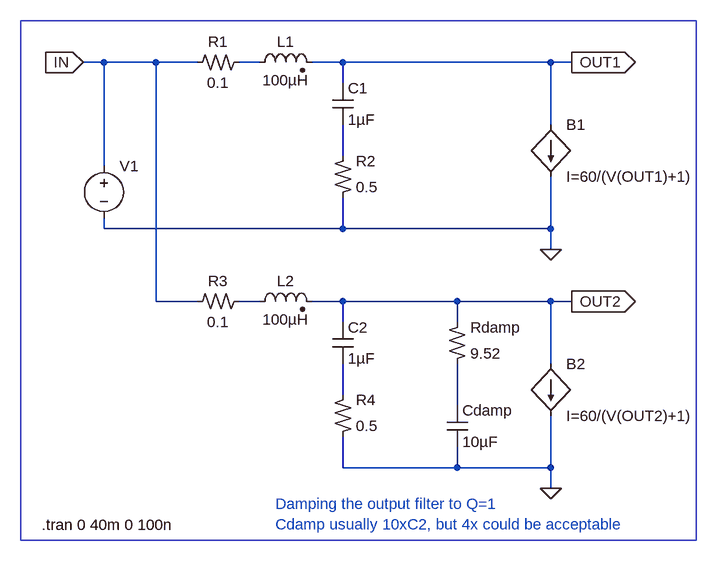
[diagram p0: schematic Switch-Mode Power Supplies - Basso- Figure 1-60.asc]
Switch-Mode Power Supplies - Basso- Figure 1-60.asc, the LTspice schematic file:
Version 4
SHEET 1 880 1052
WIRE -1888 -832 -1920 -832
WIRE -1808 -832 -1888 -832
WIRE -1744 -832 -1808 -832
WIRE -1648 -832 -1680 -832
WIRE -1520 -832 -1568 -832
WIRE -1200 -832 -1520 -832
WIRE -1168 -832 -1200 -832
WIRE -1520 -800 -1520 -832
WIRE -1200 -736 -1200 -832
WIRE -1520 -688 -1520 -736
WIRE -1888 -672 -1888 -832
WIRE -1888 -576 -1888 -592
WIRE -1520 -576 -1520 -624
WIRE -1520 -576 -1888 -576
WIRE -1200 -576 -1200 -656
WIRE -1200 -576 -1520 -576
WIRE -1200 -544 -1200 -576
WIRE -1808 -464 -1808 -832
WIRE -1744 -464 -1808 -464
WIRE -1648 -464 -1680 -464
WIRE -1520 -464 -1568 -464
WIRE -1344 -464 -1520 -464
WIRE -1200 -464 -1344 -464
WIRE -1168 -464 -1200 -464
WIRE -1520 -432 -1520 -464
WIRE -1344 -432 -1344 -464
WIRE -1200 -368 -1200 -464
WIRE -1520 -320 -1520 -368
WIRE -1344 -304 -1344 -368
WIRE -1520 -208 -1520 -256
WIRE -1344 -208 -1344 -240
WIRE -1344 -208 -1520 -208
WIRE -1200 -208 -1200 -288
WIRE -1200 -208 -1344 -208
WIRE -1200 -176 -1200 -208
FLAG -1200 -544 0
FLAG -1168 -832 OUT1
IOPIN -1168 -832 Out
FLAG -1920 -832 IN
IOPIN -1920 -832 In
FLAG -1200 -176 0
FLAG -1168 -464 OUT2
IOPIN -1168 -464 Out
SYMBOL voltage -1888 -688 R0
WINDOW 123 24 44 Left 0
WINDOW 39 0 0 Left 0
WINDOW 3 -97 133 Invisible 0
SYMATTR Value PWL(2m 150 2.000001m 130 5m 130 5.000001m 120 10m 120 10.000001m 102 20m 102 20.000001m 99 30m 99 30.000001m 94.36)
SYMATTR InstName V1
SYMBOL bi -1200 -736 R0
SYMATTR InstName B1
SYMATTR Value I=60/(V(OUT1)+1)
SYMBOL res2 -1680 -848 R90
WINDOW 0 0 32 VBottom 0
WINDOW 3 32 32 VTop 0
SYMATTR InstName R1
SYMATTR Value 0.1
SYMBOL ind2 -1664 -816 R270
WINDOW 0 32 56 VTop 0
WINDOW 3 4 56 VBottom 0
SYMATTR InstName L1
SYMATTR Value 100µH
SYMBOL res2 -1536 -624 M180
WINDOW 0 36 56 Left 0
WINDOW 3 36 16 Left 0
SYMATTR InstName R2
SYMATTR Value 0.5
SYMBOL cap -1536 -800 R0
SYMATTR InstName C1
SYMATTR Value 1µF
SYMBOL bi -1200 -368 R0
SYMATTR InstName B2
SYMATTR Value I=60/(V(OUT2)+1)
SYMBOL res2 -1680 -480 R90
WINDOW 0 0 32 VBottom 0
WINDOW 3 32 32 VTop 0
SYMATTR InstName R3
SYMATTR Value 0.1
SYMBOL ind2 -1664 -448 R270
WINDOW 0 32 56 VTop 0
WINDOW 3 4 56 VBottom 0
SYMATTR InstName L2
SYMATTR Value 100µH
SYMBOL res2 -1536 -256 M180
WINDOW 0 36 56 Left 0
WINDOW 3 36 16 Left 0
SYMATTR InstName R4
SYMATTR Value 0.5
SYMBOL cap -1536 -432 R0
SYMATTR InstName C2
SYMATTR Value 1µF
SYMBOL res2 -1360 -368 M180
WINDOW 0 36 56 Left 0
WINDOW 3 36 16 Left 0
SYMATTR InstName Rdamp
SYMATTR Value 9.52
SYMBOL cap -1360 -304 R0
SYMATTR InstName Cdamp
SYMATTR Value 10µF
TEXT -1984 -120 Left 0 !.tran 0 40m 0 100n
TEXT -1624 -152 Left 0 ;Damping the output filter to Q=1\nCdamp usually 10xC2, but 4x could be acceptable
RECTANGLE Normal -2016 -896 -976 -96

The netlist it stands for:
* Switch-Mode Power Supplies - Basso- Figure 1-60.asc
V1 IN 0 PWL(2m 150 2.000001m 130 5m 130 5.000001m 120 10m 120 10.000001m 102 20m 102 20.000001m 99 30m 99 30.000001m 94.36)
B1 OUT1 0 I=60/(V(OUT1)+1)
R1 N001 IN 0.1
L1 N001 OUT1 100µH
R2 0 N002 0.5
C1 OUT1 N002 1µF
B2 OUT2 0 I=60/(V(OUT2)+1)
R3 N003 IN 0.1
L2 N003 OUT2 100µH
R4 0 N004 0.5
C2 OUT2 N004 1µF
Rdamp N005 OUT2 9.52
Cdamp N005 0 10µF
.tran 0 40m 0 100n
* Damping the output filter to Q=1
* Cdamp usually 10xC2, but 4x could be acceptable
.backanno
.end